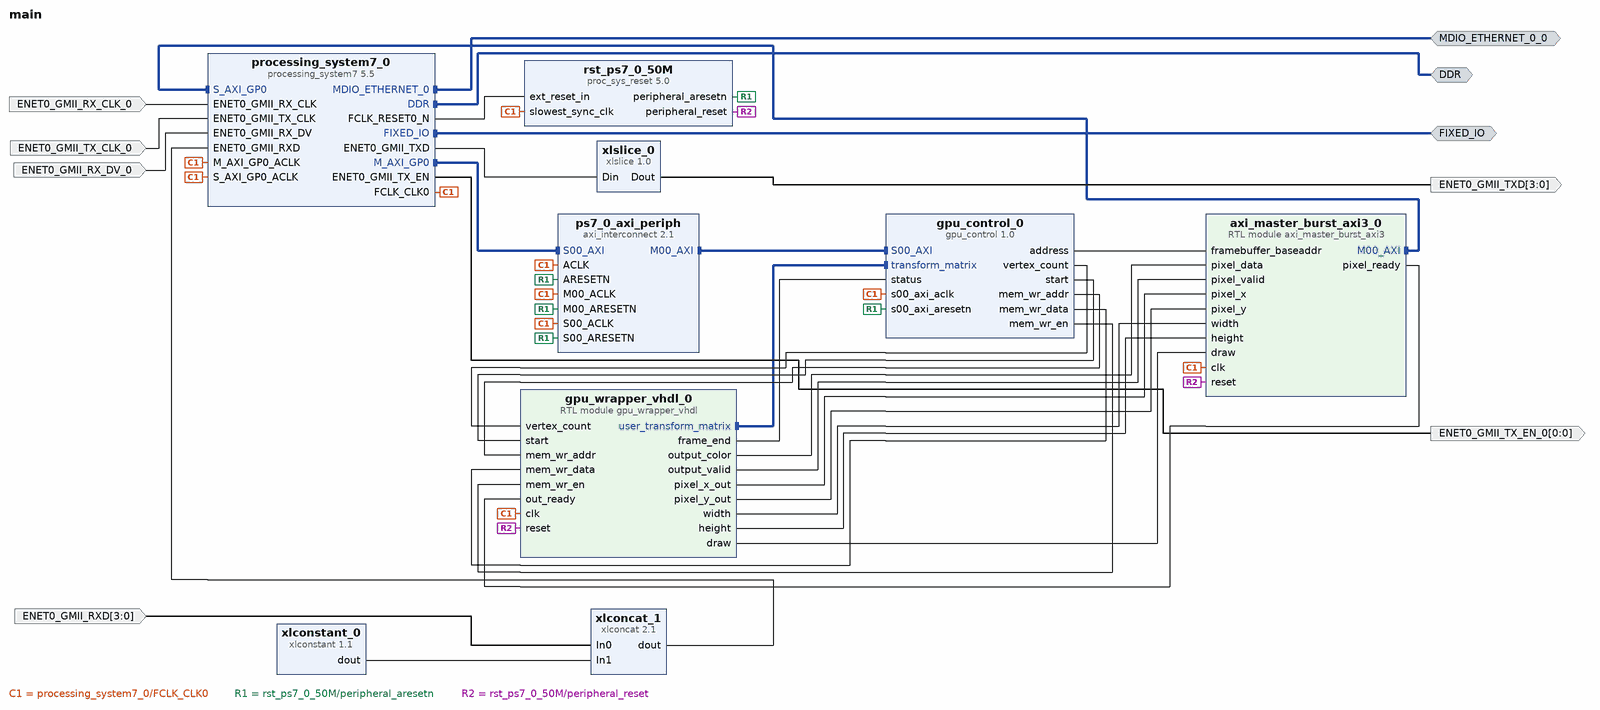
[diagram p0: block diagram of the top level]
# Vivado block design main, xc7z010clg400-1, Vivado 2018.3
create_bd_design main

create_bd_intf_port -mode Master -vlnv xilinx.com:interface:ddrx_rtl:1.0 DDR
create_bd_intf_port -mode Master -vlnv xilinx.com:display_processing_system7:fixedio_rtl:1.0 FIXED_IO
create_bd_intf_port -mode Master -vlnv xilinx.com:interface:mdio_rtl:1.0 MDIO_ETHERNET_0_0
create_bd_port -dir I -type clk ENET0_GMII_RX_CLK_0
create_bd_port -dir I -type clk ENET0_GMII_TX_CLK_0
create_bd_port -dir I ENET0_GMII_RX_DV_0
create_bd_port -dir O -from 3 -to 0 ENET0_GMII_TXD
create_bd_port -dir O -from 0 -to 0 ENET0_GMII_TX_EN_0
create_bd_port -dir I -from 3 -to 0 ENET0_GMII_RXD

create_bd_cell -type ip -vlnv xilinx.com:ip:processing_system7:5.5 processing_system7_0
set_property -dict [list \
  CONFIG.PCW_ENET0_ENET0_IO EMIO \
  CONFIG.PCW_ENET0_GRP_MDIO_ENABLE 1 \
  CONFIG.PCW_ENET0_GRP_MDIO_IO EMIO \
  CONFIG.PCW_ENET0_PERIPHERAL_ENABLE 1 \
  CONFIG.PCW_FPGA0_PERIPHERAL_FREQMHZ 100 \
  CONFIG.PCW_UART1_PERIPHERAL_ENABLE 1 \
  CONFIG.PCW_UART1_UART1_IO {MIO 24 .. 25} \
  CONFIG.PCW_UART_PERIPHERAL_FREQMHZ 100 \
  CONFIG.PCW_UIPARAM_DDR_BUS_WIDTH {16 Bit} \
  CONFIG.PCW_UIPARAM_DDR_FREQ_MHZ 533.333 \
  CONFIG.PCW_UIPARAM_DDR_PARTNO {MT41J256M16 RE-125} \
  CONFIG.PCW_USE_S_AXI_GP0 1 \
] [get_bd_cells processing_system7_0]
# 68 more settings of processing_system7_0 are not shown: defaults, MIO pin electricals, DDR timing, and values the tool derives
create_bd_cell -type ip -vlnv xilinx.com:ip:axi_interconnect:2.1 ps7_0_axi_periph
set_property -dict {CONFIG.NUM_MI 1} [get_bd_cells ps7_0_axi_periph]
create_bd_cell -type ip -vlnv xilinx.com:ip:xlconcat:2.1 xlconcat_1
set_property -dict {CONFIG.IN0_WIDTH 4 CONFIG.IN1_WIDTH 4} [get_bd_cells xlconcat_1]
create_bd_cell -type ip -vlnv xilinx.com:ip:xlconstant:1.1 xlconstant_0
set_property -dict {CONFIG.CONST_VAL 0 CONFIG.CONST_WIDTH 4} [get_bd_cells xlconstant_0]
create_bd_cell -type ip -vlnv xilinx.com:ip:proc_sys_reset:5.0 rst_ps7_0_50M
create_bd_cell -type ip -vlnv xilinx.com:user:gpu_control:1.0 gpu_control_0
create_bd_cell -type ip -vlnv xilinx.com:ip:xlslice:1.0 xlslice_0
set_property -dict {CONFIG.DIN_FROM 3 CONFIG.DIN_TO 0 CONFIG.DIN_WIDTH 8 CONFIG.DOUT_WIDTH 4} [get_bd_cells xlslice_0]
create_bd_cell -type module -reference axi_master_burst_axi3 axi_master_burst_axi3_0
create_bd_cell -type module -reference gpu_wrapper_vhdl gpu_wrapper_vhdl_0

# ---- connections ----

connect_bd_intf_net [get_bd_intf_ports MDIO_ETHERNET_0_0] [get_bd_intf_pins processing_system7_0/MDIO_ETHERNET_0]
connect_bd_intf_net [get_bd_intf_pins gpu_wrapper_vhdl_0/user_transform_matrix] [get_bd_intf_pins gpu_control_0/transform_matrix]
connect_bd_intf_net [get_bd_intf_pins processing_system7_0/M_AXI_GP0] [get_bd_intf_pins ps7_0_axi_periph/S00_AXI]
connect_bd_intf_net [get_bd_intf_pins axi_master_burst_axi3_0/M00_AXI] [get_bd_intf_pins processing_system7_0/S_AXI_GP0]
connect_bd_intf_net [get_bd_intf_ports DDR] [get_bd_intf_pins processing_system7_0/DDR]
connect_bd_intf_net [get_bd_intf_pins ps7_0_axi_periph/M00_AXI] [get_bd_intf_pins gpu_control_0/S00_AXI]
connect_bd_intf_net [get_bd_intf_ports FIXED_IO] [get_bd_intf_pins processing_system7_0/FIXED_IO]
connect_bd_net [get_bd_pins processing_system7_0/FCLK_CLK0] \
  [get_bd_pins processing_system7_0/M_AXI_GP0_ACLK] [get_bd_pins ps7_0_axi_periph/S00_ACLK] \
  [get_bd_pins ps7_0_axi_periph/M00_ACLK] [get_bd_pins ps7_0_axi_periph/ACLK] \
  [get_bd_pins processing_system7_0/S_AXI_GP0_ACLK] [get_bd_pins rst_ps7_0_50M/slowest_sync_clk] \
  [get_bd_pins gpu_control_0/s00_axi_aclk] [get_bd_pins axi_master_burst_axi3_0/clk] [get_bd_pins gpu_wrapper_vhdl_0/clk]
connect_bd_net -net gpu_control_0_vertices_size [get_bd_pins gpu_control_0/vertex_count] [get_bd_pins gpu_wrapper_vhdl_0/vertex_count]
connect_bd_net [get_bd_pins gpu_control_0/start] [get_bd_pins gpu_wrapper_vhdl_0/start]
connect_bd_net [get_bd_pins gpu_control_0/mem_wr_addr] [get_bd_pins gpu_wrapper_vhdl_0/mem_wr_addr]
connect_bd_net [get_bd_pins gpu_control_0/mem_wr_data] [get_bd_pins gpu_wrapper_vhdl_0/mem_wr_data]
connect_bd_net [get_bd_pins gpu_control_0/mem_wr_en] [get_bd_pins gpu_wrapper_vhdl_0/mem_wr_en]
connect_bd_net -net ENET0_GMII_RX_CLK_0_1 [get_bd_ports ENET0_GMII_RX_CLK_0] [get_bd_pins processing_system7_0/ENET0_GMII_RX_CLK]
connect_bd_net -net ENET0_GMII_TX_CLK_0_1 [get_bd_ports ENET0_GMII_TX_CLK_0] [get_bd_pins processing_system7_0/ENET0_GMII_TX_CLK]
connect_bd_net -net ENET0_GMII_RX_DV_0_1 [get_bd_ports ENET0_GMII_RX_DV_0] [get_bd_pins processing_system7_0/ENET0_GMII_RX_DV]
connect_bd_net [get_bd_pins processing_system7_0/ENET0_GMII_TX_EN] [get_bd_ports ENET0_GMII_TX_EN_0]
connect_bd_net [get_bd_pins xlconstant_0/dout] [get_bd_pins xlconcat_1/In1]
connect_bd_net -net In0_0_1 [get_bd_ports ENET0_GMII_RXD] [get_bd_pins xlconcat_1/In0]
connect_bd_net [get_bd_pins xlconcat_1/dout] [get_bd_pins processing_system7_0/ENET0_GMII_RXD]
connect_bd_net [get_bd_pins rst_ps7_0_50M/peripheral_aresetn] \
  [get_bd_pins ps7_0_axi_periph/ARESETN] [get_bd_pins ps7_0_axi_periph/S00_ARESETN] \
  [get_bd_pins ps7_0_axi_periph/M00_ARESETN] [get_bd_pins gpu_control_0/s00_axi_aresetn]
connect_bd_net [get_bd_pins processing_system7_0/FCLK_RESET0_N] [get_bd_pins rst_ps7_0_50M/ext_reset_in]
connect_bd_net [get_bd_pins gpu_control_0/address] [get_bd_pins axi_master_burst_axi3_0/framebuffer_baseaddr]
connect_bd_net [get_bd_pins axi_master_burst_axi3_0/pixel_ready] [get_bd_pins gpu_wrapper_vhdl_0/out_ready]
connect_bd_net [get_bd_pins gpu_wrapper_vhdl_0/output_color] [get_bd_pins axi_master_burst_axi3_0/pixel_data]
connect_bd_net [get_bd_pins gpu_wrapper_vhdl_0/output_valid] [get_bd_pins axi_master_burst_axi3_0/pixel_valid]
connect_bd_net [get_bd_pins gpu_wrapper_vhdl_0/pixel_x_out] [get_bd_pins axi_master_burst_axi3_0/pixel_x]
connect_bd_net [get_bd_pins gpu_wrapper_vhdl_0/pixel_y_out] [get_bd_pins axi_master_burst_axi3_0/pixel_y]
connect_bd_net [get_bd_pins gpu_wrapper_vhdl_0/width] [get_bd_pins axi_master_burst_axi3_0/width]
connect_bd_net [get_bd_pins gpu_wrapper_vhdl_0/height] [get_bd_pins axi_master_burst_axi3_0/height]
connect_bd_net [get_bd_pins gpu_wrapper_vhdl_0/frame_end] [get_bd_pins gpu_control_0/status]
connect_bd_net [get_bd_pins gpu_wrapper_vhdl_0/draw] [get_bd_pins axi_master_burst_axi3_0/draw]
connect_bd_net -net util_vector_logic_0_Res [get_bd_pins rst_ps7_0_50M/peripheral_reset] \
  [get_bd_pins axi_master_burst_axi3_0/reset] [get_bd_pins gpu_wrapper_vhdl_0/reset]
connect_bd_net [get_bd_pins processing_system7_0/ENET0_GMII_TXD] [get_bd_pins xlslice_0/Din]
connect_bd_net [get_bd_pins xlslice_0/Dout] [get_bd_ports ENET0_GMII_TXD]

# ---- address map ----
assign_bd_address -offset 0x00000000 -range 512M -target_address_space [get_bd_addr_spaces axi_master_burst_axi3_0/M00_AXI] [get_bd_addr_segs processing_system7_0/S_AXI_GP0/GP0_DDR_LOWOCM]
assign_bd_address -offset 0x40000000 -range 1G -target_address_space [get_bd_addr_spaces axi_master_burst_axi3_0/M00_AXI] [get_bd_addr_segs processing_system7_0/S_AXI_GP0/GP0_M_AXI_GP0]
assign_bd_address -offset 0xE0000000 -range 4M -target_address_space [get_bd_addr_spaces axi_master_burst_axi3_0/M00_AXI] [get_bd_addr_segs processing_system7_0/S_AXI_GP0/GP0_IOP]
assign_bd_address -offset 0x43C00000 -range 128K -target_address_space [get_bd_addr_spaces processing_system7_0/Data] [get_bd_addr_segs gpu_control_0/S00_AXI/S00_AXI_reg]

validate_bd_design
save_bd_design
